# Altium project BabbleVR_NVer.PrjPcb
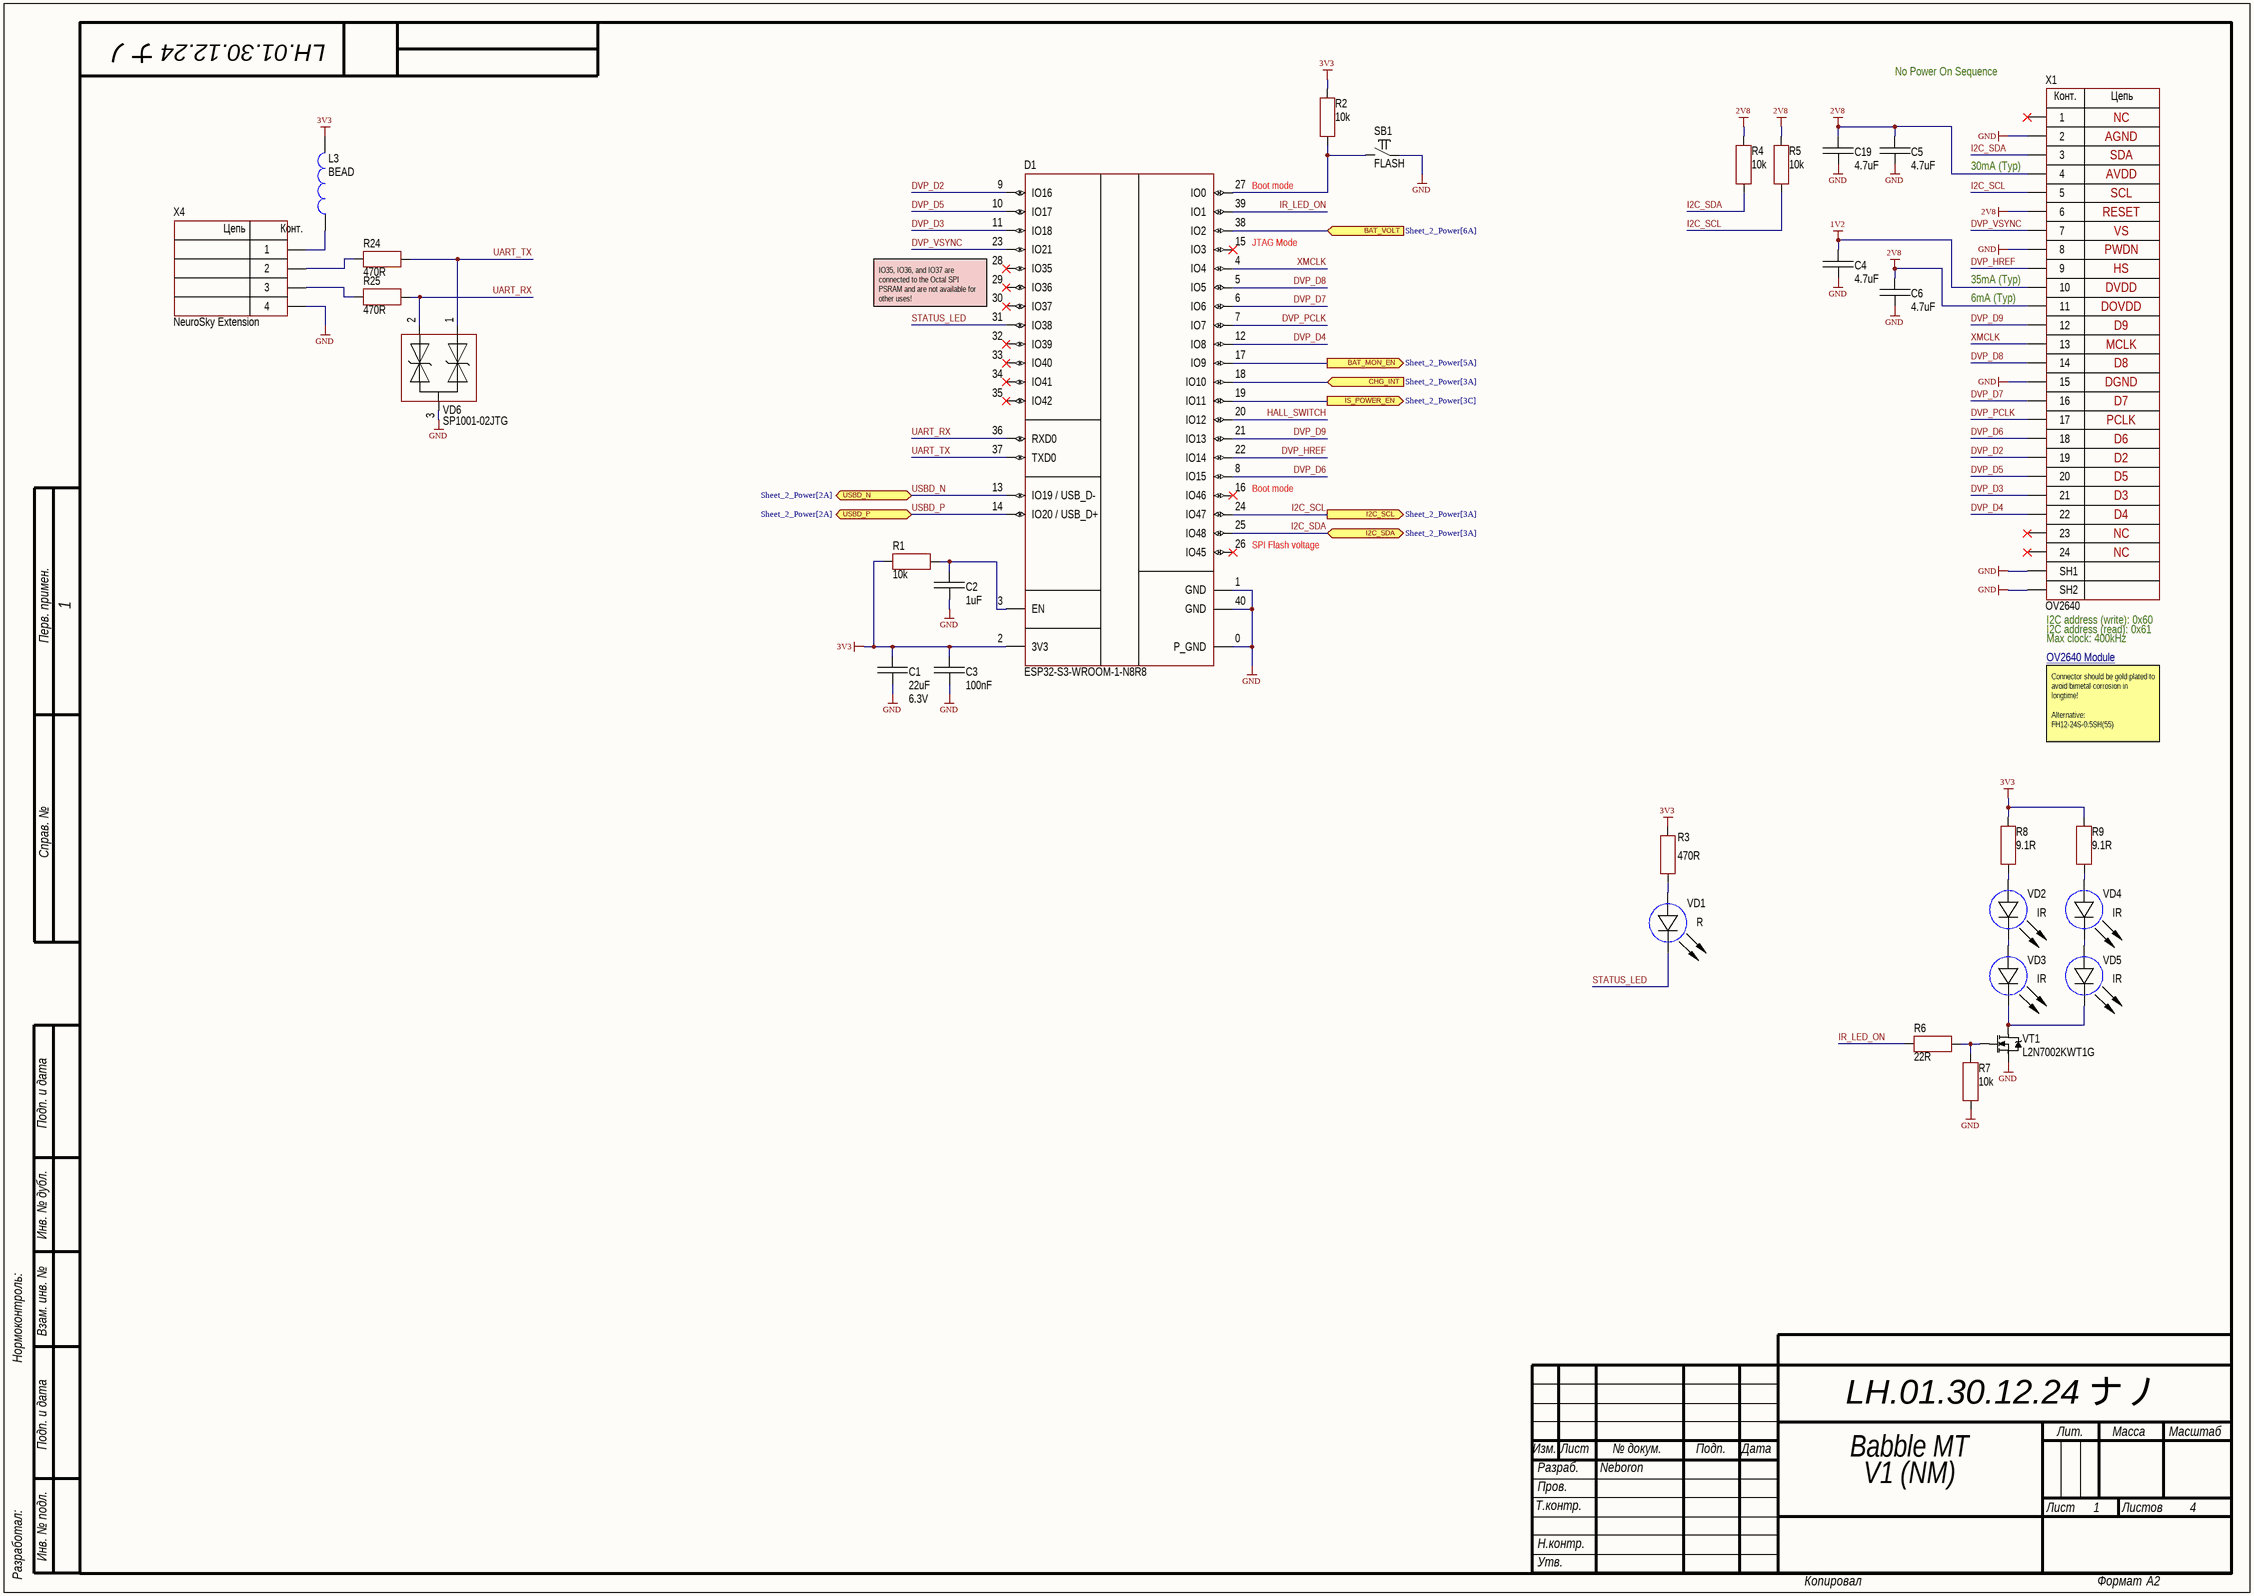
[diagram p0: Sheet_1_MCU.SchDoc]
1 sheet, 30 parts. Net scope: flat (ports and power ports of the same name join across sheets).
Board file: BabbleVR_PCB.PcbDoc

## Sheet Sheet_1_MCU.SchDoc: Babble MT
size 594 x 420 mm; PageSetup: Record=PageOptions|CenterHorizontal=True|CenterVertical=True|PrintScale=1.00|XCorrection=1.00|YCorrection=1.00|PrintKind=1|BorderSize=5000000|LeftOffset=0|BottomOffset=0|Orientation=2|PaperLength=1000|PaperWidth=1000|Scale=100|PaperSource=15|PrintQuality=1200|MediaType=1|DitherType=10|PaperKind=A3|PrintScaleMode=1; Weight: -; ScaleFactor: -; NormInspection: Норм.Контр.; FirstApplication: FA; DrawnBy: Neboron; DocumentNumber: LH.01.30.12.24 ナノ; SheetNumber: 1; SheetTotal: 4; Format: A2; Title1str: V1 (NM); ImagePath: 1

### Parts
C1  value 22uF  Voltage: 6.3V  [CAP: 0603]
C2  value 1uF  [CAP: 0402]
C3  value 100nF  [CAP: 0402]
C4  value 4.7uF  [CAP: 0402]
C5  value 4.7uF  [CAP: 0402]
C6  value 4.7uF  [CAP: 0402]
C19  value 4.7uF  [CAP: 0402]
D1  (no value)  [MOD: ESP32-S3-WROOM-1]
L3  value BEAD  [IND: 0402]
R1  value 10k  [RES: 0402]
R2  value 10k  [RES: 0402]
R3  value 470R  [RES: 0402]
R4  value 10k  [RES: 0402]
R5  value 10k  [RES: 0402]
R6  value 22R  [RES: 0402]
R7  value 10k  [RES: 0402]
R8  value 9.1R  [RES: 0603]
R9  value 9.1R  [RES: 0603]
R24  value 470R  [RES: 0402]
R25  value 470R  [RES: 0402]
SB1  CommentText: FLASH  [BUT: TS-1186F-B-A]
VD1  Color: R  [LED: 0402R]
VD2  Color: IR  [LED: 1206R]
VD3  Color: IR  [LED: 1206R]
VD4  Color: IR  [LED: 1206R]
VD5  Color: IR  [LED: 1206R]
VD6  PartNumber: SP1001-02JTG  [SC-70]
VT1  PartNumber: L2N7002KWT1G  [SC-70]
X1  CommentText: OV2640  [CON: FFC/FPC-24-0.5(Hirose)]
X4  CommentText: NeuroSky Extension  [CON: SM04B-GHS]

### Ports
BAT_MON_EN (out, see Sheet_2_Power[5A]), BAT_VOLT (in, see Sheet_2_Power[6A]), CHG_INT (in, see Sheet_2_Power[3A]), I2C_SCL (out, see Sheet_2_Power[3A]), I2C_SDA (bidir, see Sheet_2_Power[3A]), IS_POWER_EN (out, see Sheet_2_Power[3C]), USBD_N (bidir, see Sheet_2_Power[2A]), USBD_P (bidir, see Sheet_2_Power[2A])

### Nets
1V2: C4.1 X1.10
2V8: C5.1 C6.1 C19.1 R4.1 R5.1 X1.4 X1.6 X1.11
3V3: C1.2 C3.2 D1.2(3V3) L3.1 R1.2 R2.1 R3.2 R8.2 R9.2
GND: C1.1 C2.1 C3.1 C4.2 C5.2 C6.2 C19.2 D1.0(P_GND) D1.1(GND) D1.40(GND) R7.2 SB1.1 VD6.3 VT1.3(S) X1.2 X1.8 X1.15 X1.SH1 X1.SH2 X4.4
BAT_MON_EN: D1.17(IO9) ; port BAT_MON_EN
BAT_VOLT: D1.38(IO2) ; port BAT_VOLT
CHG_INT: D1.18(IO10) ; port CHG_INT
DVP_D2: D1.9(IO16) X1.19
DVP_D3: D1.11(IO18) X1.21
DVP_D4: D1.12(IO8) X1.22
DVP_D5: D1.10(IO17) X1.20
DVP_D6: D1.8(IO15) X1.18
DVP_D7: D1.6(IO6) X1.16
DVP_D8: D1.5(IO5) X1.14
DVP_D9: D1.21(IO13) X1.12
DVP_HREF: D1.22(IO14) X1.9
DVP_PCLK: D1.7(IO7) X1.17
DVP_VSYNC: D1.23(IO21) X1.7
HALL_SWITCH: D1.20(IO12)
I2C_SCL: D1.24(IO47) R5.2 X1.5 ; port I2C_SCL
I2C_SDA: D1.25(IO48) R4.2 X1.3 ; port I2C_SDA
IR_LED_ON: D1.39(IO1) R6.2
IS_POWER_EN: D1.19(IO11) ; port IS_POWER_EN
STATUS_LED: D1.31(IO38) VD1.1(C)
UART_RX: D1.36(RXD0) R25.1 VD6.2
UART_TX: D1.37(TXD0) R24.1 VD6.1
USBD_N: D1.13(IO19_/_USB_D-) ; port USBD_N
USBD_P: D1.14(IO20_/_USB_D+) ; port USBD_P
XMCLK: D1.4(IO4) X1.13
NetC2_2: C2.2 D1.3(EN) R1.1
NetD1_27: D1.27(IO0) R2.2 SB1.2
NetL3_2: L3.2 X4.1
NetR3_1: R3.1 VD1.2(A)
NetR6_1: R6.1 R7.1 VT1.1(G)
NetR8_1: R8.1 VD2.2(A)
NetR9_1: R9.1 VD4.2(A)
NetR24_2: R24.2 X4.2
NetR25_2: R25.2 X4.3
NetVD2_1: VD2.1(C) VD3.2(A)
NetVD3_1: VD3.1(C) VD5.1(C) VT1.2(D)
NetVD4_1: VD4.1(C) VD5.2(A)

Not connected (* = marked no-connect by the designer): D1 15(IO3)* 16(IO46)* 26(IO45)* 28(IO35)* 29(IO36)* 30(IO37)* 32(IO39)* 33(IO40)* 34(IO41)* 35(IO42)*; X1 1* 23* 24*

### Notes on the sheet
- No Power On Sequence
- NC
- (near X1) 30mA (Typ)
- AGND
- SDA
- AVDD
- Boot mode
- SCL
- RESET
- (near D1) JTAG Mode
- VS
- PWDN
- HS
- (near D1) IO35, IO36, and IO37 are connected to the Octal SPI PSRAM and are not available for other uses!
- (near X1) 35mA (Typ)
- (near X1) 6mA (Typ)
- DVDD
- DOVDD
- D9
- MCLK
- D8
- DGND
- D7
- PCLK
- D6
- D2
- (near D1) Boot mode
- D5
- D3
- (near D1) SPI Flash voltage
- D4
- (near X1) I2C address (write): 0x60
- (near X1) I2C address (read): 0x61
- Max clock: 400kHz
- OV2640 Module <https://www.aliexpress.com/i/1005003079676671.html?gatewayAdapt=4itemAdapt>
- Connector should be gold plated to avoid bimetal corrosion in longtime!
  Alternative:
  FH12-24S-0.5SH(55)
- Перв. примен.
- Справ. №
- Подп. и дата
- Инв. № дубл.
- Нормоконтроль:
- Взам. инв. №
- Изм.
- Лист
- № докум.
- Подп.
- Дата
- Лит.
- Масса
- Масштаб
- Т.контр.
- Пров.
- Разраб.
- Листов
- Разработал:
- Инв. № подл.
- Н.контр.
- Утв.
- Копировал
- Формат
- (in symbol Connector_FFC_24 (TF31-24S-0.5SH(800))) Конт.; Цепь
- (in symbol Connector_SM04B) Цепь; Конт.

### Library data of the parts
C1 = Ceramic_0603: Manufacturer: Any; ValueManufacturerPartNumber: Ceramic capacitor, 22uF, X5R, ±10%, 6.3V, 0603, -55...+125°C; TypeCapacitor: Ceramic capacitor; Tolerance: ±10%; TypeDielectric: X5R; Package: 0603; Temperature: -55...+125°C
C2 = Ceramic_0402: Manufacturer: Any; ValueManufacturerPartNumber: Ceramic capacitor, 1uF, X7R, ±10%, 6.3V, 0402, -55...+125°C; TypeCapacitor: Ceramic capacitor; Tolerance: ±10%; TypeDielectric: X7R; Voltage: 6.3V; Package: 0402; Temperature: -55...+125°C
C3 = Ceramic_0402: Manufacturer: Any; ValueManufacturerPartNumber: Ceramic capacitor, 100nF, X7R, ±10%, 16V, 0402, -55...+125°C; TypeCapacitor: Ceramic capacitor; Tolerance: ±10%; TypeDielectric: X7R; Voltage: 16V; Package: 0402; Temperature: -55...+125°C
C4-C6 C19 = Ceramic_0402: Manufacturer: Any; ValueManufacturerPartNumber: Ceramic capacitor, 4.7uF, X7R, ±10%, 16V, 0402, -55...+125°C; TypeCapacitor: Ceramic capacitor; Tolerance: ±10%; TypeDielectric: X7R; Voltage: 16V; Package: 0402; Temperature: -55...+125°C
D1 = ESP32-S3-WROOM-1-N8R8: Wi-Fi; Manufacturer: Espressif Systems; ValueManufacturerPartNumber: Wi-Fi module, WiFi 802.11 b/g/n (802.11n up to 150 Mbps) / Bluetooth v4.2 BR/EDR and BLE specification, 32 bit, SD card, UART, SPI, SDIO, I2C, LED PWM, Motor PWM, I2S, IR, pulse counter, GPIO, capacitive touch sensor, ADC, DAC, -40...+85°C, 18x25.5x3.1; Core: 32 bit; TypeInterface: SD card, UART, SPI, SDIO, I2C, LED PWM, Motor PWM, I2S, IR, pulse counter, GPIO, capacitive touch sensor, ADC, DAC; TypeStandart: WiFi 802.11 b/g/n (802.11n up to 150 Mbps) / Bluetooth v4.2 BR/EDR and BLE specification; HelpURL: https://www.espressif.com/sites/default/files/documentation/esp32-s3-wroom-1_wroom-1u_datasheet_en.pdf; Package: 18x25.5x3.1; ComponentType: Wi-Fi module; Temperature: -40...+85°C; PartNumber: ESP32-S3-WROOM-1-N8R8
L3 = Inductor_0402: Manufacturer: Murata Electronics; PartNumber: BLM15PX601SN1D; ValueManufacturerPartNumber: Fixed inductor, BEAD, ±25%, 0402, 900mA, -55...+125°C; TypeInductor: Fixed inductor; MaxCurrent: 900mA; Tolerance: ±25%; Package: 0402; HelpURL: https://www.lcsc.com/datasheet/lcsc_datasheet_2304140030_Murata-Electronics-BLM15PX601SN1D_C160977.pdf; Temperature: -55...+125°C
R1 R2 R4 R5 R7 = Resistor_0402: Manufacturer: Any; ValueManufacturerPartNumber: Resistor film, 10k, ±5%, 0402, 0.063W, -55...+125°C; TypeResistor: Resistor film; Power: 0.063W; Tolerance: ±5%; Package: 0402; Temperature: -55...+125°C
R3 R24 R25 = Resistor_0402: Manufacturer: Yageo; PartNumber: RC0402JR-07100RL; ValueManufacturerPartNumber: Resistor film, 470R, ±5%, 0402, 0.063W, -55...+125°C; TypeResistor: Resistor film; Power: 0.063W; Tolerance: ±5%; Package: 0402; HelpURL: https://www.digikey.com/product-detail/en/yageo/RC0402JR-07100RL/311-100JRCT-ND/729362; Temperature: -55...+125°C
R6 = Resistor_0402: Manufacturer: Any; ValueManufacturerPartNumber: Resistor film, 22R, ±5%, 0402, 0.063W, -55...+125°C; TypeResistor: Resistor film; Power: 0.063W; Tolerance: ±5%; Package: 0402; Temperature: -55...+125°C
R8 R9 = Resistor_0603: Manufacturer: Any; ValueManufacturerPartNumber: Resistor film, 9.1R, ±5%, 0603, 0.1W, -55...+125°C; TypeResistor: Resistor film; Power: 0.1W; Tolerance: ±5%; Package: 0603; Temperature: -55...+125°C
SB1 = Button_tactile: Manufacturer: XKB Connection; ValueManufacturerPartNumber: Tactile button, TS-1186F; PartNumber: TS-1186F-C-A; TypeButton: Tactile button; HelpURL: https://www.lcsc.com/product-detail/Tactile-Switches_XKB-Connection-TS-1186F-C-A_C908471.html; Package: TS-1186F
VD1 = LED_single: ValueManufacturerPartNumber: LED, Green, *, *, *, -55...+150°C; TypeDiode: LED; ColorParameter: Green; Manufacturer: *; Package: *; HelpURL: *; Temperature: -55...+150°C; Current: *; VoltageDrop: *; PartNumber: *
VD2-VD5 = LED_single: Manufacturer: XINGLIGHT; ValueManufacturerPartNumber: LED, 850...858nm, 35mA, 1.5V, 1206, -55...+150°C; PartNumber: XL-3216HIRC-850; TypeDiode: LED; Current: 35mA; VoltageDrop: 1.5V; ColorParameter: 850...858nm; Package: 1206; HelpURL: https://www.lcsc.com/datasheet/lcsc_datasheet_2409271733_XINGLIGHT-XL-3216HIRC-850_C965891.pdf; Temperature: -55...+150°C
VD6 = TVS_array: Manufacturer: Littelfuse; TypeDiode: TVS; Current: 2A; Voltage: 5.5V; Package: SC-70-3; HelpURL: https://www.lcsc.com/datasheet/lcsc_datasheet_2410010304_Littelfuse-SP1001-02JTG_C151300.pdf; ValueManufacturerPartNumber: =TypeDiode+', '+Voltage+', '+Current+', '+VoltageDrop+', '+RecoveryTime+', '+Package+', '+Temperature; Temperature: -55...+150°C
VT1 = MOSFET_N_123: Manufacturer: LRC; ValueManufacturerPartNumber: MOSFET N-channel transistor, 60V, 380mA, , 300mW, 2.3Ohm, 34pF, SC-70, -55...+150°C; TypeTransistor: MOSFET N-channel transistor; VoltageDS: 60V; CurrentDS: 380mA; RDS: 2.3Ohm; InputCapacitor: 34pF; MaxPower: 300mW; Package: SC-70; HelpURL: https://www.lcsc.com/datasheet/lcsc_datasheet_2111041830_LRC-L2N7002KWT1G_C2912011.pdf; Temperature: -55...+150°C
X1 = Connector_FFC_24 (TF31-24S-0.5SH(800)): Manufacturer: Hirose; ValueManufacturerPartNumber: Connector, 24pin, 0.5mm, FFC/FPC, 0.5A; VoltageMax: FFC/FPC; Pitch: 0.5mm; CurrentMax: 0.5A; Multichannel: 24pin; HelpURL: https://www.lcsc.com/datasheet/lcsc_datasheet_2410291517_HRS-Hirose-TF31-24S-0-5SH-800_C3169854.pdf; TypeConnector: Connector; PartNumber: TF31-24S-0.5SH(800)
X4 = Connector_SM04B: Manufacturer: JST; ValueManufacturerPartNumber: Connector, 4pin, 1.25mm, 50VDC, 1A; PartNumber: SM04B-GHS; VoltageMax: 50VDC; Pitch: 1.25mm; CurrentMax: 1A; Multichannel: 4pin; HelpURL: https://www.digikey.com/product-detail/en/jst-sales-america-inc/SM04B-GHS-TB-LF-SN/455-1566-1-ND/807834; TypeConnector: Connector

## Assembly variants
PrototypeVariant: not fitted R?